# Altium schematic sheet STM32_ResetCircuitry.SchDoc
size Letter
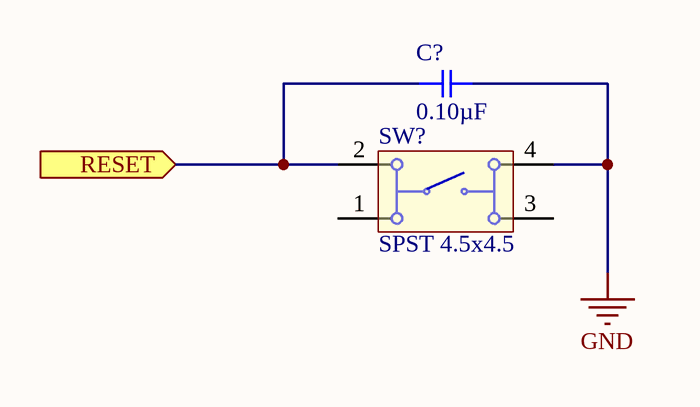
[diagram p0: STM32_ResetCircuitry.SchDoc]

## Parts
C?  0.10µF  [SMD-0603C]
SW?  SPST 4.5x4.5  [430181038816]

## Ports
RESET (in)

## Nets
GND: C?.2 SW?.4
RESET: C?.1 SW?.2 ; port RESET

Not connected (* = marked no-connect by the designer): SW? 1 3

## Library data of the parts
C? = GCJ188R71H104KA12D: CAP CER 0.1UF 50V X7R 0603; Manufacturer: Murata Electronics North America; Factory Stock: 0; Unit Price (USD): 0.12; Minimum Quantity: 1; Tolerance: ±10%; Datasheets: http://www.murata.com/~/media/webrenewal/support/library/catalog/products/capacitor/mlcc/c03e.ashx; Image: //media.digikey.com/Renders/Murata%20Renders/0603%28LQG18%29.jpg; Digi-Key Part Number: 490-5798-1-ND; Part Number: GCJ188R71H104KA12D; Quantity Available: 163695; @ qty: 0; Packaging: Cut Tape (CT); Series: GCJ; Part Status: Active; Value: 0.10µF; Voltage: 50V; Temperature Coefficient: X7R; Operating Temperature: -55°C ~ 125°C; Features: Soft Termination; Ratings: AEC-Q200; Applications: Automotive, Boardflex Sensitive; Mounting Type: Surface Mount, MLCC; Package / Case: 0603 (1608 Metric); Size / Dimension: 0.063" L x 0.031" W (1.60mm x 0.80mm); Height - Seated (Max): -; Thickness (Max): 0.035" (0.90mm); Lead Spacing: -; Lead Style: -
SW? = SPST 4.5x4.5: WS-TASV SMD Tact Switch 4.5X4.5 mm; NoPins: 04; PackageReference: 430181038816; PartNumber: 430181038816; ComponentLink1Description: Manufacturer URL; ComponentLink1URL: http://www.we-online.com; ComponentLink2Description: Datasheet; ComponentLink2URL: http://katalog.we-online.de/em/datasheet/430181038816.pdf